# EasyEDA Pro project STM32G431RBT6.epro, board PCB1
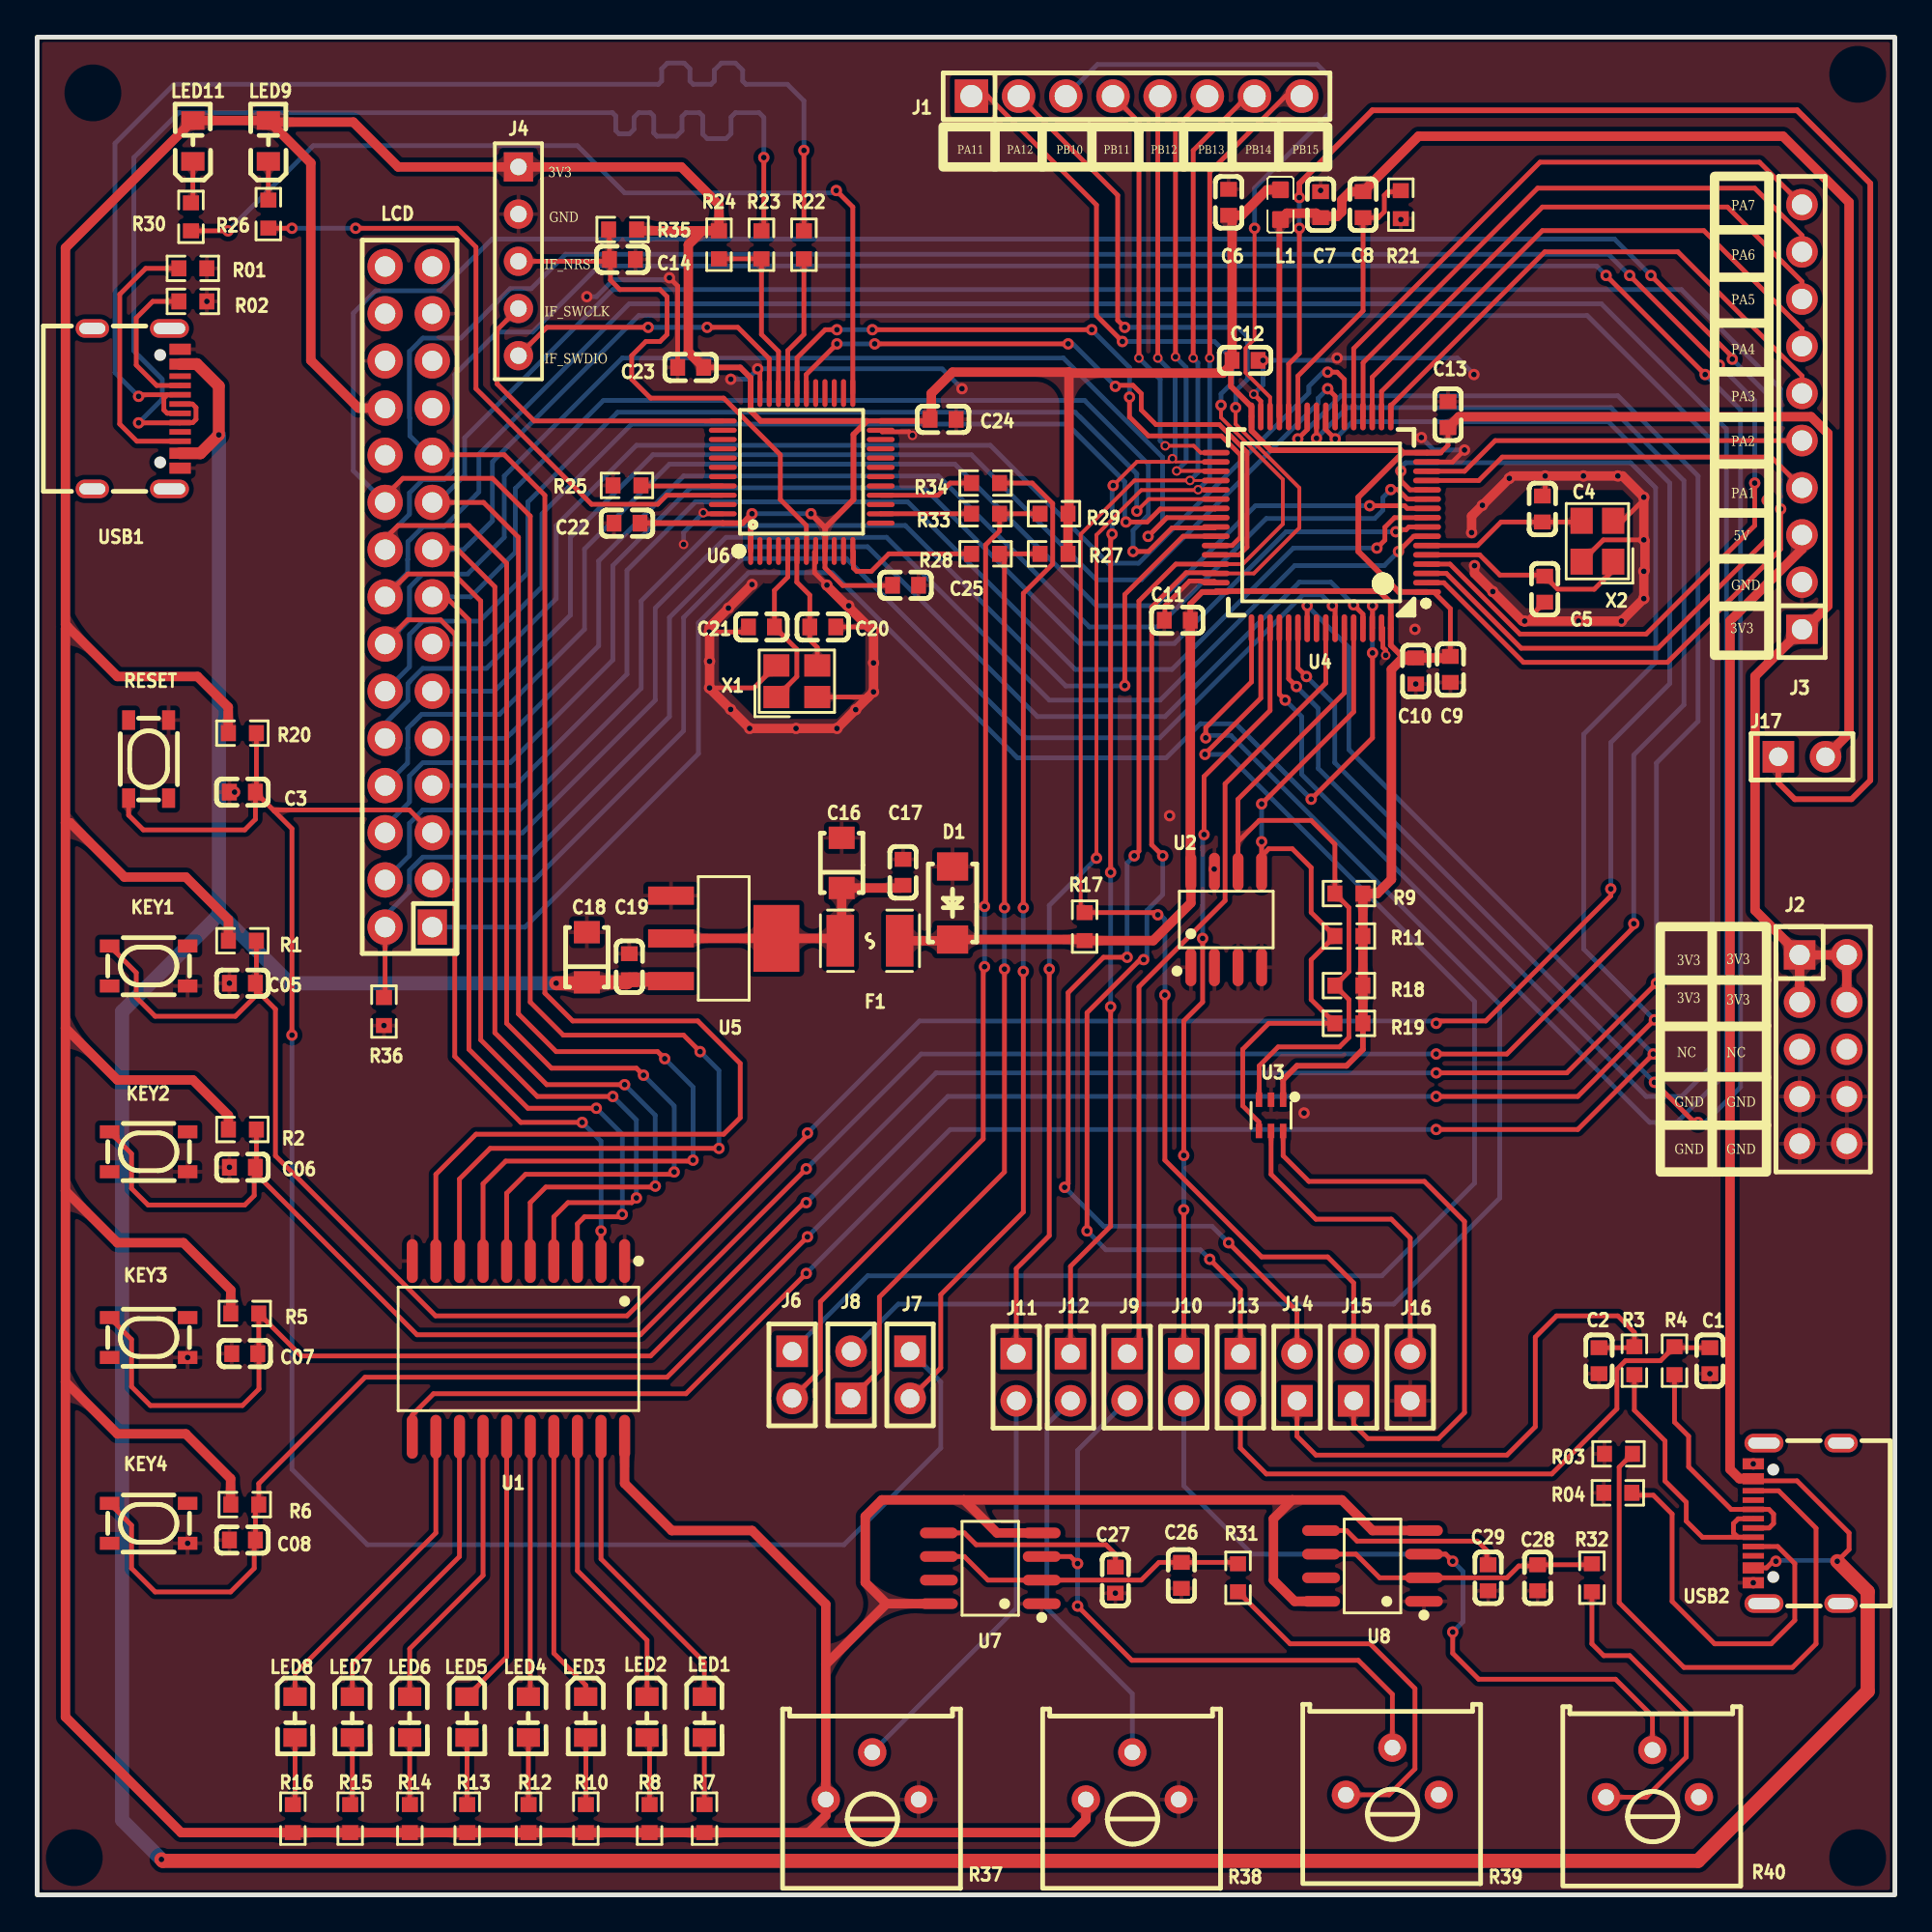
[diagram p1: board, top side]
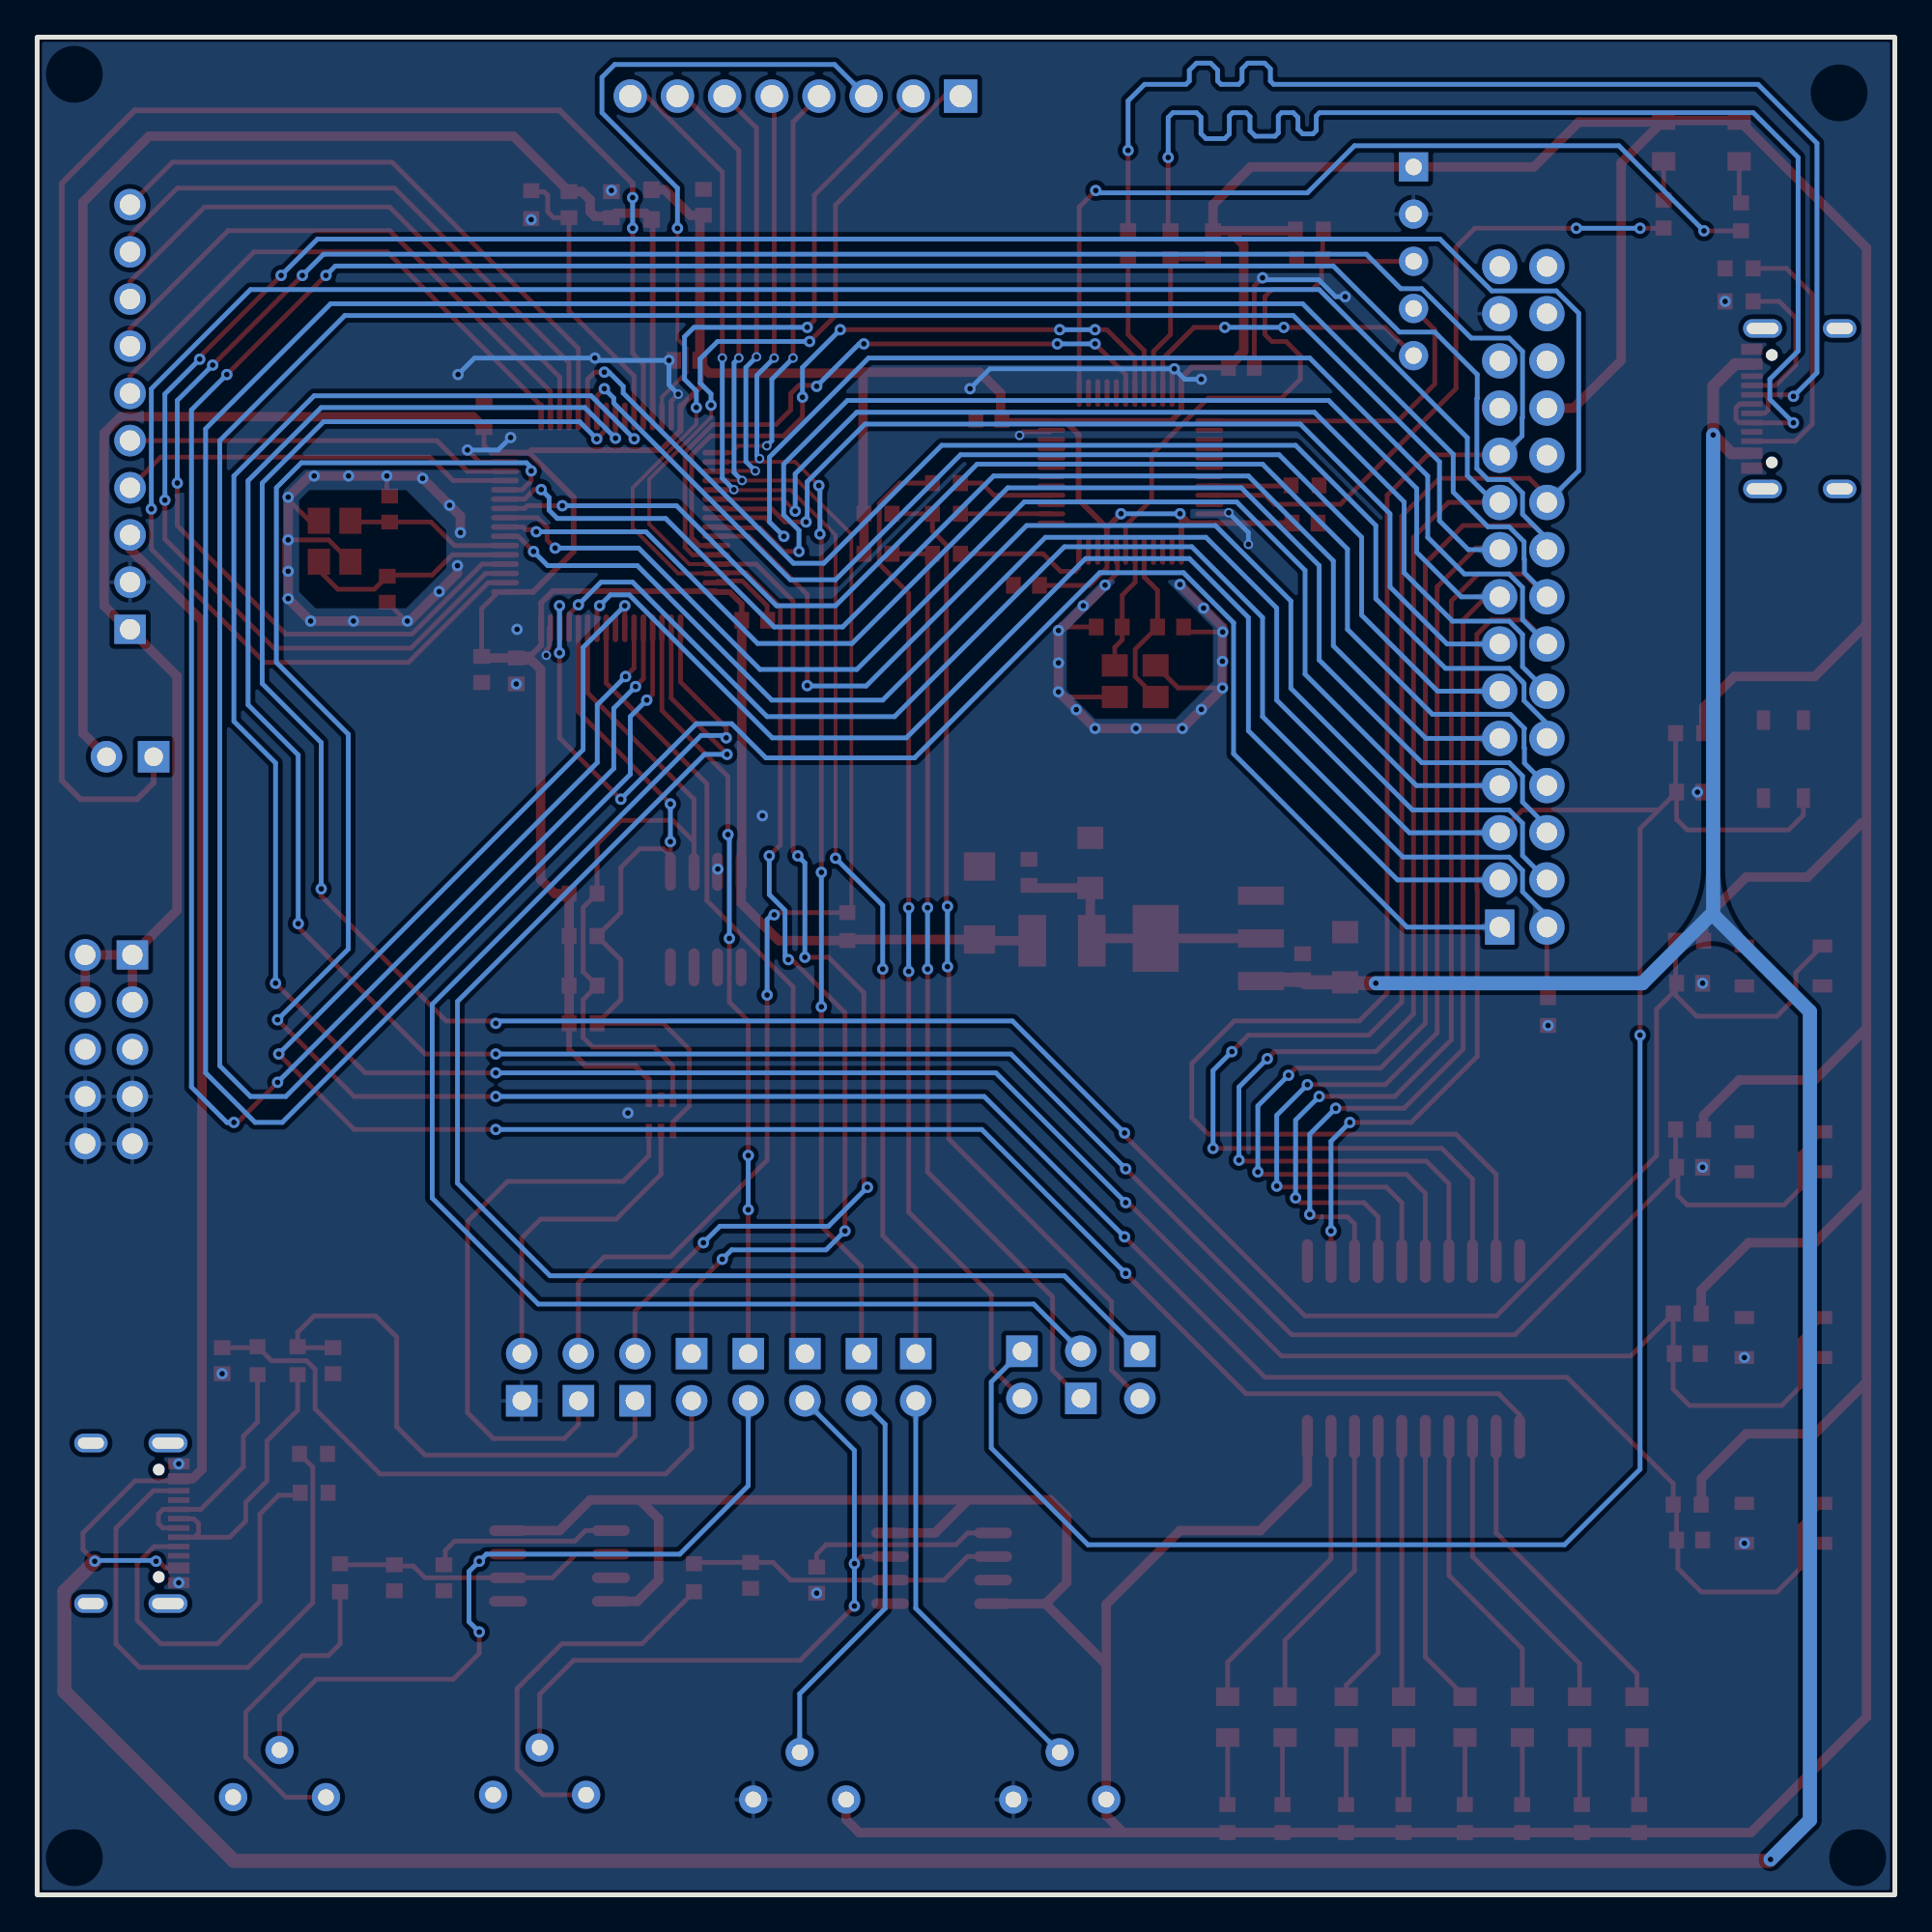
[diagram p2: board, bottom side, seen from below]

Outline 100 x 100 mm; copper layers: Top Layer, Bottom Layer. Coordinates in mm from the lower left corner of the outline.
Outline path: rectangle 0,100 100,0
Stack: Top Layer 0.035mm / Dielectric1 1.51mm FR4 er 4.5 / Bottom Layer 0.035mm

## Design rules (mm)
template: 自定义配置
spacing copperThickness1oz (default): track to track 0.102, other pairs 0.152 to 0.3
spacing copperThickness2oz: track to track 0.203, other pairs 0.152 to 0.3
track width copperThickness1oz (default): min 0.127, default 0.254, max 2.54
track width copperThickness2oz: min 0.203, default 0.254, max 2.54
differential pair differentialPair (default): width min 0.127, default 0.254, max 2.54; gap min 0.152, default 0.152
via viaSize (default): diameter min 0.5, default 0.61, max 10; hole min 0.3, default 0.305, max 6.299

## Placement (name value [footprint] x y rotation side)
C1  20pF  [C0603]  90.04 28.75 270 top
C2  20pF  [C0603]  84.07 28.75 270 top
C3  100nF  [C0603]  11.05 59.36 0 top
C4  20pF  [C0603]  81.03 74.6 270 top
C5  20pF  [C0603]  81.15 70.28 90 top
C05  100nF  [C0603]  11.05 49.07 0 top
C6  100nF  [C0603]  64.13 91.11 270 top
C06  100nF  [C0603]  11.05 39.17 0 top
C7  1uF  [C0603]  69.09 90.98 270 top
C07  100nF  [C0603]  11.18 29.13 0 top
C08  100nF  [C0603]  11.05 19.1 0 top
C8  100nF  [C0603]  71.37 90.98 90 top
C9  100nF  [C0603]  76.07 65.96 90 top
C10  100nF  [C0603]  74.21 65.88 90 top
C11  100nF  [C0603]  61.37 68.61 0 top
C12  100nF  [C0603]  65.02 82.6 180 top
C13  100nF  [C0603]  75.95 79.68 270 top
C14  100nF  [C0603]  31.51 88.04 180 top
C16  22uF  [CAP-SMD_L3.2-W1.6]  43.31 55.55 90 top
C17  100nF  [C0603]  46.61 55.04 270 top
C18  22uF  [CAP-SMD_L3.2-W1.6]  29.59 50.47 90 top
C19  100nF  [C0603]  31.88 49.96 270 top
C20  20pF  [C0603]  42.29 68.25 180 top
C21  20pF  [C0603]  38.99 68.25 0 top
C22  100nF  [C0603]  31.75 73.84 0 top
C23  100nF  [C0603]  35.18 82.22 0 top
C24  100nF  [C0603]  48.77 79.43 180 top
C25  100nF  [C0603]  46.75 70.49 180 top
C26  100nF  [C0603]  61.59 17.2 270 top
C27  10nF  [C0603]  58.04 16.94 270 top
C28  100nF  [C0603]  80.77 17.07 270 top
C29  10nF  [C0603]  78.1 17.07 270 top
D1  SS14  [SMA_L4.2-W2.6-LS5.0-RD_1]  49.28 53.39 90 top
F1  ASMD1210-075-24V  [F1210]  44.83 51.36 0 top
J1  -  [HDR-TH_8P-P2.54-V-F-1]  59.18 96.83 0 top
J2  -  [HDR-TH_10P-P2.54-V-F-R2-C5-S2.54]  96.14 45.52 270 top
J3  -  [HDR-TH_10P-P2.54-V-F]  95 79.55 90 top
J4  HDR-M-2.54_1x5  [HDR-M-2.54_1X5]  25.91 87.94 270 top
J6  -  [HDR-TH_2P-P2.54-V-F]  40.64 27.99 270 top
J7  -  [HDR-TH_2P-P2.54-V-F]  46.99 27.99 270 top
J8  -  [HDR-TH_2P-P2.54-V-F]  43.81 27.99 90 top
J9  -  [HDR-TH_2P-P2.54-V-F]  58.67 27.86 270 top
J10  -  [HDR-TH_2P-P2.54-V-F]  61.72 27.86 270 top
J11  -  [HDR-TH_2P-P2.54-V-F]  52.71 27.86 270 top
J12  -  [HDR-TH_2P-P2.54-V-F]  55.63 27.86 270 top
J13  -  [HDR-TH_2P-P2.54-V-F]  64.77 27.86 270 top
J14  -  [HDR-TH_2P-P2.54-V-F]  67.82 27.86 90 top
J15  -  [HDR-TH_2P-P2.54-V-F]  70.87 27.86 90 top
J16  -  [HDR-TH_2P-P2.54-V-F]  73.91 27.86 90 top
J17  -  [HDR-TH_2P-P2.54-V-F]  95 61.27 0 top
KEY1  SKRPACE010  [KEY-SMD_4P-L4.2-W3.2-P2.20-LS4.6]  6 50 0 top
KEY2  SKRPACE010  [KEY-SMD_4P-L4.2-W3.2-P2.20-LS4.6]  6 40 0 top
KEY3  SKRPACE010  [KEY-SMD_4P-L4.2-W3.2-P2.20-LS4.6]  6 30 0 top
KEY4  SKRPACE010  [KEY-SMD_4P-L4.2-W3.2-P2.20-LS4.6]  6 20 0 top
L1  600Ω@100MHz  [L0603磁珠]  66.93 90.98 270 top
LCD  -  [HDR-TH_30P-P2.54-V-F-R2-C15-S2.54]  20 69.87 90 top
LED1  NCD0805R1  [LED0805-RD]  35.91 9.57 270 top
LED2  NCD0805R1  [LED0805-RD]  32.83 9.57 270 top
LED3  NCD0805R1  [LED0805-RD]  29.53 9.57 270 top
LED4  NCD0805R1  [LED0805-RD]  26.44 9.57 270 top
LED5  NCD0805R1  [LED0805-RD]  23.14 9.57 270 top
LED6  NCD0805R1  [LED0805-RD]  20.05 9.57 270 top
LED7  NCD0805R1  [LED0805-RD]  16.97 9.57 270 top
LED8  NCD0805R1  [LED0805-RD]  13.88 9.57 270 top
LED9  LED0805-G  [LED0805-RD_GREEN]  12.45 94.41 90 top
LED11  NCD0805R1  [LED0805-RD]  8.38 94.41 90 top
R1  10kΩ  [R0603]  11.05 51.36 180 top
R01  5.1kΩ  [R0603]  8.38 87.55 0 top
R2  10kΩ  [R0603]  11.05 41.2 180 top
R02  5.1kΩ  [R0603]  8.38 85.78 0 top
R03  5.1kΩ  [R0603]  85.12 23.74 180 top
R3  33Ω  [R0603]  85.98 28.75 90 top
R04  5.1kΩ  [R0603]  85.09 21.64 180 top
R4  33Ω  [R0603]  88.14 28.75 90 top
R5  10kΩ  [R0603]  11.18 31.29 180 top
R6  10kΩ  [R0603]  11.18 21.01 180 top
R7  300Ω  [R0603]  35.92 4.1 90 top
R8  300Ω  [R0603]  32.97 4.1 90 top
R9  10kΩ  [R0603]  70.61 53.9 0 top
R10  300Ω  [R0603]  29.54 4.1 90 top
R11  10kΩ  [R0603]  70.61 51.61 0 top
R12  300Ω  [R0603]  26.45 4.1 90 top
R13  300Ω  [R0603]  23.15 4.1 90 top
R14  300Ω  [R0603]  20.06 4.1 90 top
R15  300Ω  [R0603]  16.85 4.1 90 top
R16  300Ω  [R0603]  13.76 4.1 90 top
R17  10kΩ  [R0603]  56.39 52.12 90 top
R18  10kΩ  [R0603]  70.61 48.95 0 top
R19  10kΩ  [R0603]  70.61 46.91 0 top
R20  10kΩ  [R0603]  11.05 62.53 0 top
R21  0Ω  [R0603]  73.41 90.98 90 top
R22  33Ω  [R0603]  41.28 88.82 270 top
R23  33Ω  [R0603]  38.99 88.82 270 top
R24  1.5kΩ  [R0603]  36.7 88.82 270 top
R25  100kΩ  [R0603]  31.75 75.87 180 top
R26  300Ω  [R0603]  12.45 90.47 90 top
R27  1.5kΩ  [R0603]  54.74 72.19 0 top
R28  22Ω  [R0603]  51.05 72.19 180 top
R29  1.5kΩ  [R0603]  54.74 74.35 0 top
R30  510Ω  [R0603]  8.28 90.33 90 top
R31  100Ω  [R0603]  64.64 17.07 90 top
R32  100Ω  [R0603]  83.69 17.07 90 top
R33  22Ω  [R0603]  51.05 74.35 180 top
R34  22Ω  [R0603]  51.05 76 180 top
R35  10kΩ  [R0603]  31.51 89.64 0 top
R36  10kΩ  [R0603]  18.67 47.55 90 top
R37  10kΩ  [RES-ADJ-TH_3P-L9.5-W9.5-P2.50-L_3386P]  44.95 6.4 180 top
R38  10kΩ  [RES-ADJ-TH_3P-L9.5-W9.5-P2.50-L_3386P]  58.95 6.4 180 top
R39  10kΩ  [RES-ADJ-TH_3P-L9.5-W9.5-P2.50-L_3386P]  72.95 6.66 180 top
R40  10kΩ  [RES-ADJ-TH_3P-L9.5-W9.5-P2.50-L_3386P]  86.95 6.53 180 top
RESET  SKRPACE010  [KEY-SMD_4P-L4.2-W3.2-P2.20-LS4.6]  6 61.14 90 top
U1  SN74HC573ADWR  [SOIC-20_L13.0-W7.6-P1.27-LS10.3-BL]  25.91 29.39 180 top
U2  M24C02-WMN6TP  [SOIC-8_L4.9-W3.9-P1.27-LS6.0-BL]  64.01 52.5 0 top
U3  MCP4017T-104E/LT  [SC-70-6_L2.2-W1.3-P0.65-LS2.1-BL]  66.42 41.96 180 top
U4  STM32G431RBT6  [LQFP-64_L10.0-W10.0-P0.50-LS12.0-BL]  69.13 73.88 90 top
U5  AMS1117-3.3  [SOT-223-4_L6.5-W3.5-P2.30-LS7.0-BR]  36.96 51.49 180 top
U6  STM32F103C8T6  [LQFP-48_L7.0-W7.0-P0.50-LS9.0-BL]  41.16 76.59 0 top
U7  XL555  [SOP-8_L5.0-W4.0-P1.27-LS6.0-BL]  51.31 17.58 90 top
U8  XL555  [SOP-8_L5.0-W4.0-P1.27-LS6.0-BL]  71.88 17.7 90 top
USB1  TYPE-C16PIN  [USB-C-SMD_TYPE-C16PIN]  5.33 80 270 top
USB2  TYPE-C16PIN  [USB-C-SMD_TYPE-C16PIN]  94.74 20 90 top
X1  8MHz  [CRYSTAL-SMD_4P-L3.2-W2.5-BL]  40.89 65.33 0 top
X2  24MHz  [CRYSTAL-SMD_4P-L3.2-W2.5-BL]  83.99 72.87 90 top

## Footprints (pads in the part's own frame, mm; a bottom-side part is the same pattern mirrored in y, then rotated)
C0603
  rect 0.8x0.9 smd: 1(-0.7,0) 2(0.7,0)
CAP-SMD_L3.2-W1.6
  rect 1.2x1.4 smd: 1(-1.35,0) 2(1.35,0)
CRYSTAL-SMD_4P-L3.2-W2.5-BL
  rect 1.4x1.2 smd: 1(-1.1,-0.85) 2(1.1,-0.85) 3(1.1,0.85) 4(-1.1,0.85)
F1210
  rect 1.485x2.781 smd: 1(-1.6,0) 2(1.6,0)
HDR-M-2.54_1X5
  rect 1.575x1.575 hole 0.889: 1(-5.08,0)
  round 1.575 hole 0.889: 2(-2.54,0) 3(0,0) 4(2.54,0) 5(5.08,0)
HDR-TH_2P-P2.54-V-F
  rect 1.7x1.7 hole 1: 1(-1.27,0)
  round 1.7 hole 1: 2(1.27,0)
HDR-TH_8P-P2.54-V-F-1
  rect 1.8x1.8 hole 1.2: 1(-8.89,0)
  round 1.8 hole 1.2: 2(-6.35,0) 3(-3.81,0) 4(-1.27,0) 5(1.27,0) 6(3.81,0) 7(6.35,0) 8(8.89,0)
HDR-TH_10P-P2.54-V-F
  rect 1.575x1.7 hole 1.1: 1(-11.43,0)
  round 1.7 hole 1.1: 2(-8.89,0) 3(-6.35,0) 4(-3.81,0) 5(-1.27,0) 6(1.27,0) 7(3.81,0) 8(6.35,0) 9(8.89,0) 10(11.43,0)
HDR-TH_10P-P2.54-V-F-R2-C5-S2.54
  rect 1.575x1.7 hole 1.1: 1(-5.08,-1.27)
  round 1.7 hole 1.1: 2(-5.08,1.27) 3(-2.54,-1.27) 4(-2.54,1.27) 5(0,-1.27) 6(0,1.27) 7(2.54,-1.27) 8(2.54,1.27) 9(5.08,-1.27) 10(5.08,1.27)
HDR-TH_30P-P2.54-V-F-R2-C15-S2.54
  rect 1.9x1.575 hole 1.1: 1(-17.78,-1.27)
  round 1.9 hole 1.1: 2(-17.78,1.27) 3(-15.24,-1.27) 4(-15.24,1.27) 5(-12.7,-1.27) 6(-12.7,1.27) 7(-10.16,-1.27) 8(-10.16,1.27) 9(-7.62,-1.27) 10(-7.62,1.27) 11(-5.08,-1.27) 12(-5.08,1.27) 13(-2.54,-1.27) 14(-2.54,1.27) 15(0,-1.27) 16(0,1.27) 17(2.54,-1.27) 18(2.54,1.27) 19(5.08,-1.27) 20(5.08,1.27) 21(7.62,-1.27) 22(7.62,1.27) 23(10.16,-1.27) 24(10.16,1.27) 25(12.7,-1.27) 26(12.7,1.27) 27(15.24,-1.27) 28(15.24,1.27) 29(17.78,-1.27) 30(17.78,1.27)
KEY-SMD_4P-L4.2-W3.2-P2.20-LS4.6
  rect 1.05x0.7 smd: 1(-2.1,1.075) 2(2.1,1.075) 3(-2.1,-1.075) 4(2.1,-1.075)
L0603磁珠
  custom 0.9x0.9 smd: 1(-0.8,0) 2(0.8,0)
LED0805-RD
  rect 1x1.25 smd: 1(-1.1,0) 2(1.1,0)
LED0805-RD_GREEN
  rect 1x1.25 smd: 1(-1.1,0) 2(1.1,0)
LQFP-48_L7.0-W7.0-P0.50-LS9.0-BL
  oval 0.27x1.5 smd: 1(-2.75,-4.25) 2(-2.25,-4.25) 3(-1.75,-4.25) 4(-1.25,-4.25) 5(-0.75,-4.25) 6(-0.25,-4.25) 7(0.25,-4.25) 8(0.75,-4.25) 9(1.25,-4.25) 10(1.75,-4.25) 11(2.25,-4.25) 12(2.75,-4.25) 25(2.75,4.25) 26(2.25,4.25) 27(1.75,4.25) 28(1.25,4.25) 29(0.75,4.25) 30(0.25,4.25) 31(-0.25,4.25) 32(-0.75,4.25) 33(-1.25,4.25) 34(-1.75,4.25) 35(-2.25,4.25) 36(-2.75,4.25)
  oval 1.5x0.27 smd: 13(4.25,-2.75) 14(4.25,-2.25) 15(4.25,-1.75) 16(4.25,-1.25) 17(4.25,-0.75) 18(4.25,-0.25) 19(4.25,0.25) 20(4.25,0.75) 21(4.25,1.25) 22(4.25,1.75) 23(4.25,2.25) 24(4.25,2.75) 37(-4.25,2.75) 38(-4.25,2.25) 39(-4.25,1.75) 40(-4.25,1.25) 41(-4.25,0.75) 42(-4.25,0.25) 43(-4.25,-0.25) 44(-4.25,-0.75) 45(-4.25,-1.25) 46(-4.25,-1.75) 47(-4.25,-2.25) 48(-4.25,-2.75)
LQFP-64_L10.0-W10.0-P0.50-LS12.0-BL
  oval 0.3x1.5 smd: 1(-3.75,-5.688) 2(-3.25,-5.688) 3(-2.75,-5.688) 4(-2.25,-5.688) 5(-1.75,-5.688) 6(-1.25,-5.688) 7(-0.75,-5.688) 8(-0.25,-5.688) 9(0.25,-5.688) 10(0.75,-5.688) 11(1.25,-5.688) 12(1.75,-5.688) 13(2.25,-5.688) 14(2.75,-5.688) 15(3.25,-5.688) 16(3.75,-5.688) 33(3.75,5.688) 34(3.25,5.688) 35(2.75,5.688) 36(2.25,5.688) 37(1.75,5.688) 38(1.25,5.688) 39(0.75,5.688) 40(0.25,5.688) 41(-0.25,5.688) 42(-0.75,5.688) 43(-1.25,5.688) 44(-1.75,5.688) 45(-2.25,5.688) 46(-2.75,5.688) 47(-3.25,5.688) 48(-3.75,5.688)
  oval 1.5x0.3 smd: 17(5.7,-3.738) 18(5.7,-3.238) 19(5.7,-2.738) 20(5.7,-2.238) 21(5.7,-1.738) 22(5.7,-1.238) 23(5.7,-0.739) 24(5.7,-0.238) 25(5.7,0.262) 26(5.7,0.762) 27(5.7,1.262) 28(5.7,1.762) 29(5.7,2.261) 30(5.7,2.762) 31(5.7,3.261) 32(5.7,3.762) 49(-5.7,3.762) 50(-5.7,3.261) 51(-5.7,2.762) 52(-5.7,2.261) 53(-5.7,1.762) 54(-5.7,1.262) 55(-5.7,0.762) 56(-5.7,0.262) 57(-5.7,-0.238) 58(-5.7,-0.739) 59(-5.7,-1.238) 60(-5.7,-1.738) 61(-5.7,-2.238) 62(-5.7,-2.738) 63(-5.7,-3.238) 64(-5.7,-3.738)
R0603
  rect 0.806x0.864 smd: 1(-0.753,0) 2(0.753,0)
RES-ADJ-TH_3P-L9.5-W9.5-P2.50-L_3386P
  round 1.524 hole 0.85: 1(-2.5,1.27) 2(0,-1.27) 3(2.5,1.27)
SC-70-6_L2.2-W1.3-P0.65-LS2.1-BL
  rect 0.35x0.78 smd: 1(-0.65,-0.84) 2(0,-0.84) 3(0.65,-0.84) 4(0.65,0.84) 5(0,0.84) 6(-0.65,0.84)
SMA_L4.2-W2.6-LS5.0-RD_1
  rect 1.52x1.68 smd: 1(-1.965,0) 2(1.965,0)
SOIC-8_L4.9-W3.9-P1.27-LS6.0-BL
  oval 0.588x2.045 smd: 1(-1.905,-2.57) 2(-0.635,-2.57) 3(0.635,-2.57) 4(1.905,-2.57) 5(1.905,2.57) 6(0.635,2.57) 7(-0.635,2.57) 8(-1.905,2.57)
SOIC-20_L13.0-W7.6-P1.27-LS10.3-BL
  oval 0.595x2.36 smd: 1(-5.715,-4.73) 2(-4.445,-4.73) 3(-3.175,-4.73) 4(-1.905,-4.73) 5(-0.635,-4.73) 6(0.635,-4.73) 7(1.905,-4.73) 8(3.175,-4.73) 9(4.445,-4.73) 10(5.715,-4.73) 11(5.715,4.73) 12(4.445,4.73) 13(3.175,4.73) 14(1.905,4.73) 15(0.635,4.73) 16(-0.635,4.73) 17(-1.905,4.73) 18(-3.175,4.73) 19(-4.445,4.73) 20(-5.715,4.73)
SOP-8_L5.0-W4.0-P1.27-LS6.0-BL
  oval 0.574x2.035 smd: 1(-1.905,-2.768) 2(-0.635,-2.768) 3(0.635,-2.768) 4(1.905,-2.768) 5(1.905,2.768) 6(0.635,2.768) 7(-0.635,2.768) 8(-1.905,2.768)
SOT-223-4_L6.5-W3.5-P2.30-LS7.0-BR
  rect 2.47x0.98 smd: 1(2.835,-2.3) 2(2.835,0) 3(2.835,2.3)
  rect 2.47x3.6 smd: 4(-2.835,0)
USB-C-SMD_TYPE-C16PIN
  oval 1x2.1 hole 0.6x1.7: 1(-4.32,1.788) 2(4.32,1.788)
  oval 1x1.8 hole 0.6x1.4: 3(-4.32,-2.362) 4(4.32,-2.362)
  rect 0.6x1.15 smd: A1B12(-3.2,2.362) A4B9(-2.4,2.362) B1A12(3.2,2.362) B4A9(2.4,2.362)
  rect 0.3x1.15 smd: A5(-1.25,2.362) A6(-0.25,2.362) A7(0.25,2.362) A8(1.25,2.362) B5(1.75,2.362) B6(0.75,2.362) B7(-0.75,2.362) B8(-1.75,2.362)

## Nets
As in the schematic.

Pads without a net: J2 5 6; KEY1 2 3; KEY2 2 3; KEY3 2 3; KEY4 2 3; LCD 22 23 25 28 29 30; R39 1; R40 1; RESET 2 3; U4 56; U6 2 3 4 10 11 13 15 17 18 19 20 21 22 26 27 28 29 38 39 40 41 42 43 46; U7 7; U8 7; USB1 1 2 3 4 A8 B8; USB2 1 2 3 4 A8 B8

## Via types
v1: diameter 0.61, hole 0.305, Top Layer to Bottom Layer, 190 vias
v2: diameter 0.508, hole 0.305, Top Layer to Bottom Layer, 15 vias

## Routing (per net, layer and track width the routed paths; a pad name or vN(x,y) marks a point on that pad's centre or on a via; arc(x,y) is an arc through that point)
GND: length 128.7
  Top Layer w0.254: v1(86.49,72.94) 84.31,72.94 X2.4 ; v1(36.18,67.98) 38.02,67.98 38.29,68.25 ; U6.47 35.92,74.34 v2(35.86,74.4) ; U6.35 38.91,82.02 v1(38.78,82.14) ; U4.31 65.87,80.4 v2(65.49,80.78) ; C4.1 81.18,75.45 v1(81.18,76.38) ; U4.63 72.44,68.18 72.44,67.15 72.59,67 v2(72.59,66.73) ; 39.79,66.18 38.58,64.97 v1(36.19,64.97) ; U4.15 76.19,77.13 v1(76.84,77.78) ; X1.2 44.74,64.48 ; v2(47.12,78.56) 46.92,78.75 45.49,78.75 U6.23 ; C20.1 44.76,68.25 ; C11.1 60.71,68.64 60.71,69.39 62.04,70.73 62.64,70.73 62.66,70.7 63.37,70.7 U4.47 ; v1(42.51,70.5) 41.85,71.17 41.85,72.28 U6.8 ; 86.49,75.11 85.35,73.97 X2.2 ; C5.1 80.14,68.57 ; C23.1 34.48,86.6 v1(34.04,87.05)
  Top Layer w0.508: v1(38.48,70.54) v1(37.21,69.27) 36.18,68.23 v1(36.18,67.98) 36.19,67.97 v1(36.19,66.4) v1(36.19,64.97) 36.19,64.95 v1(37.33,63.81) v1(38.35,62.79) v1(40.85,62.79) v1(43.05,62.79) v1(44.06,63.8) v1(45.02,64.76) v1(45.02,66.32) v1(45.02,68.06) 44.83,68.25 44.76,68.25 43.69,69.32 v1(43.69,69.39) 43.58,69.39 42.51,70.46 v1(42.51,70.5) ; v1(77.22,73.33) 77.22,74.22 v1(77.8,74.8) v1(79.25,76.25) 79.38,76.38 v1(81.18,76.38) v1(83.24,76.38) v1(85.09,76.38) 85.34,76.38 v1(86.49,75.23) v1(86.49,72.94) 86.55,72.88 86.55,71.31 v1(86.49,71.25) v1(86.49,69.77) v1(85.28,68.57) v1(82.97,68.57) v1(80.07,68.57) 79.95,68.57 v1(78.36,70.16) 77.37,71.14 v1(77.37,71.55)
  Bottom Layer w0.254: v2(65.49,80.78) 65.99,81.28 v1(65.99,82.6) 69.85,82.6 v1(69.98,82.73) 76.45,82.73 v1(77.34,81.84) ; v1(76.84,77.78) 75.19,77.78 v1(74.51,78.45) ; v2(34.8,72.69) 34.8,73.34 v2(35.86,74.4) ; v1(34.04,87.05) 33.93,86.94 31.02,86.94 30.1,86.03 v1(29.59,86.03) ; v1(37.34,81.58) 38.23,81.58 v1(38.78,82.14) 48.72,82.14 v1(49.78,81.08)
  vias: v1(8.1,28.93) v1(8.1,18.93) v1(9.14,85.78) v1(10.35,49.07) v1(10.35,39.17) v1(10.63,59.36) v1(18.67,46.8) v1(58.04,16.24) v1(60.96,58.09) v1(63.36,55.22) v1(68.2,42.09) v1(69.09,91.75) v1(73.41,90.18) v1(74.17,68.12) v1(74.21,65.18) v1(90.04,28.05) v1(92.38,23.2) v1(92.38,16.8)
GND-ADC: length 15.3
  Top Layer w0.254: R21.2 73.34,91.67 72.7,91.67 72.52,91.49 72.52,90.6 72.2,90.28 C8.1 71.37,85.27 67.87,81.76 U4.27
VDD: length 604
  Top Layer w0.254: C9.2 76.07,69.24 75.18,70.13 U4.1 ; 75.55,77.63 75.95,78.03 C13.2 ; U6.9 42.41,71.44 43.36,70.48 46.03,70.48 C25.2
  Top Layer w0.305: 73.52,77.63 71.12,75.23 71.12,72.31 73.3,70.13 U4.1 ; 73.52,77.63 73.38,77.77 66.42,77.77 65.37,78.82 U4.32 65.37,80.1 64.26,81.2 64.26,82.35 ; 73.52,77.63 U4.16 75.55,77.63 ; U6.9 42.41,72.43 42.42,72.44 42.42,73.58 ; R19.2 71.37,45.51 70.49,44.63 67.82,44.63 67.07,43.88 U3.1 ; U6.24 47.98,79.34 C24.2 ; U6.1 38.41,74.27 37.97,73.84 36.91,73.84 U6.48 32.45,73.84 C22.2 ; C23.2 37.85,82.22 38.41,81.66 U6.36 38.41,79.88 38.95,79.34 44.67,79.34 43.94,78.61 43.94,75.11 42.42,73.58 ; C10.2 74.03,66.76 73.37,66.76 72.87,67.26 U4.64 72.87,69.55 72.24,70.18 63.49,70.18 U4.48 62.72,70.13 62.07,69.49 C11.2 ; 42.42,73.58 v1(41.66,74.35)
  Top Layer w0.508: 1.52,37.9 4.32,35.1 7.87,35.1 10.42,32.55 R5.2 ; 1.52,37.9 1.52,27.61 ; 1.52,37.9 1.52,46.66 ; 1.52,27.61 1.52,9.58 7.75,3.35 R16.1 R15.1 R14.1 R13.1 R12.1 R10.1 R8.1 R7.1 41.53,3.35 ; 1.52,27.61 4.32,24.82 8,24.82 10.41,22.4 10.41,21.01 R6.2 ; 55.54,81.97 49.28,81.97 48.13,80.82 48.13,79.49 C24.2 ; 55.54,81.97 55.59,81.92 63.83,81.92 64.26,82.35 64.26,82.54 C12.2 64.32,90.22 C6.2 64.83,90.41 66.21,91.78 L1.1 ; 55.54,81.97 55.54,74.4 R29.2 R27.2 ; R19.2 R18.2 R11.2 R9.2 72.14,53.9 72.9,54.66 72.9,65.96 73.41,66.47 74.1,66.47 C10.2 75.99,66.58 C9.2 ; U7.4 51.67,19.48 49.89,21.26 ; 1.63,68.27 1.52,68.16 1.52,57.71 ; 1.63,68.27 1.52,68.38 1.52,88.65 LED11.2 LED9.2 ; 1.63,68.27 4.32,65.58 8.64,65.58 10.29,63.93 10.29,62.54 R20.1 ; C11.2 62.07,55.1 U2.8 62.1,53.39 60.08,51.37 R17.1 56.33,51.43 D1.1 49.21,51.36 46.43,51.36 ; R38.3 56.45,4.05 55.75,3.35 41.53,3.35 ; R1.2 10.3,52.49 8,54.79 4.7,54.79 1.78,57.71 1.52,57.71 ; 45.72,15.67 44.58,16.81 44.58,20.37 45.47,21.26 49.89,21.26 ; 45.72,15.67 U7.8 ; 45.72,15.67 42.45,12.4 ; 1.52,46.66 1.52,57.71 ; 1.52,46.66 4.32,43.87 8.38,43.87 10.3,41.95 R2.2 ; 49.89,21.26 67.56,21.26 ; 67.56,21.26 70.23,21.26 71.88,19.61 U8.4 ; 67.56,21.26 66.55,20.24 66.55,16.94 67.69,15.8 U8.8 ; 41.53,3.35 42.45,4.27 R37.3 42.45,12.4 ; C23.2 35.29,82.81 35.29,82.84 35.05,83.07 35.05,88.82 35.81,89.58 ; J2.1 J2.3 ; J2.1 92.47,53 92.47,65.6 95,68.12 95.12,68.12 96.39,69.39 96.39,78.67 95.49,79.57 76.53,79.57 C13.2 ; J2.1 J2.2 J2.4 ; 35.81,89.58 32.34,89.58 R35.2 ; 35.81,89.58 R24.1 36.7,90.98 34.67,93.02 J4.1 19.43,93.02 17.02,95.43 12.53,95.43 14.73,93.23 14.73,82.6 17.3,80.03 LCD.24 ; 42.45,12.4 42.45,15.64 38.48,19.61 34.16,19.61 31.62,22.15 U1.20
  Bottom Layer w0.254: v1(38.48,74.35) v1(41.66,74.35)
VDD-ADC: length 75.5
  Top Layer w0.305: L1.2 66.87,90.12 U4.29
  Top Layer w0.508: L1.2 67.27,90.53 68.84,90.53 C7.2 69.15,90.35 69.98,90.35 70.23,90.6 70.23,91.24 70.68,91.68 C8.2 74.36,94.67 93.98,94.67 97.54,91.11 97.54,62.53 J17.2
ADC-VREF: length 86
  Top Layer w0.254: v1(67.94,89.71) 67.94,82.98 67.37,82.4 U4.28
  Top Layer w0.305: v1(67.94,91.36) 67.94,92.13 71.88,96.06 94.74,96.06 98.68,92.13 98.68,60 97.66,58.98 94.62,58.98 93.73,59.86 J17.1
  Bottom Layer w0.254: v1(67.94,91.36) v1(67.94,89.71)
IF_NRST: length 32.2
  Top Layer w0.254: C14.2 30.71,87.94 J4.3 ; C14.2 30.81,89.6 R35.1 ; C14.2 30.86,87.98 30.86,86.92 31.37,86.41 33.53,86.41 33.91,86.03 33.91,84 33.53,83.62 32.77,83.62 32,82.86 32,81.58 33.02,80.57 36.96,80.57 40,77.52 40,75.11 41.41,73.71 U6.7
IF_SWCLK: length 17.5
  Top Layer w0.254: J4.4 24.77,84.25 24.77,81.33 26.76,79.34 U6.37
IF_SWDIO: length 16.7
  Top Layer w0.254: U6.34 39.41,82.69 37.72,84.38 v1(36.07,84.38) ; J4.5 27.43,84.38 v1(32.89,84.38)
  Bottom Layer w0.254: v1(32.89,84.38) v1(36.07,84.38)
LCD_RST: length 174.2
  Top Layer w0.254: v1(13.72,46.28) 13.72,57.39 12.77,58.34 ; R20.2 11.8,59.41 11.75,59.36 ; 11.75,59.36 11.75,57.9 11.18,57.33 5.72,57.33 4.92,58.12 RESET.1 ; 11.75,59.36 12.77,58.34 ; 12.77,58.34 12.82,58.4 20.04,58.4 LCD.5 ; v1(73.28,72.31) 74.1,73.13 U4.7
  Bottom Layer w0.254: v1(13.72,46.28) 13.72,22.91 17.78,18.85 43.43,18.85 48.64,24.05 48.64,27.61 46.99,29.26 ; LCD.5 26.13,57.17 33.27,64.31 33.27,69.27 37.08,73.08 45.72,73.08 54.48,64.31 60.45,64.31 67.69,71.55 72.52,71.55 v1(73.28,72.31)
OSC-IN: length 9.1
  Top Layer w0.254: U6.5 40.41,70.94 39.69,70.22 C21.2 40.89,67.05 40.89,65.58 X1.1
OSC-OUT: length 6.6
  Top Layer w0.254: U6.6 40.89,72.33 40.89,70.66 41.59,69.97 C20.2 41.59,67.55 41.99,67.15 41.99,66.18
PA0: length 150.3
  Top Layer w0.254: KEY4.1 5.08,19.9 5.08,17.58 6.35,16.31 10.41,16.31 11.68,17.58 11.68,19.04 11.75,19.1 11.75,20.83 R6.1 11.93,22.14 17.65,27.86 33.91,27.86 v1(41.47,35.42) ; v1(87.06,47.1) 82.93,42.98 v1(75.31,42.98) ; v1(73.41,76.65) 73.41,76.12 73.9,75.63 U4.12
  Bottom Layer w0.254: v1(75.31,42.98) 49.02,42.98 v1(41.47,35.42) ; v1(87.06,47.1) 83.25,50.91 83.25,62.47 87.12,66.34 87.12,75.74 85.78,77.09 73.66,77.09 73.41,76.83 v1(73.41,76.65)
PA1: length 21.4
  Top Layer w0.254: U4.13 77.61,76.13 78.87,77.39 93.35,77.39 J3.4
PA2: length 20.9
  Top Layer w0.254: J3.5 78.49,78.28 76.84,76.63 U4.14
PA3: length 29.8
  Top Layer w0.254: U4.17 72.87,80.16 81.15,88.44 88.32,88.44 95,81.77 J3.6
PA4: length 30.7
  Top Layer w0.254: U4.18 72.37,80.93 81.03,89.59 89.72,89.59 95,84.31 J3.7
PA5: length 31.6
  Top Layer w0.254: U4.19 71.87,81.7 81.03,90.86 90.99,90.86 95,86.85 95,85.9
PA6: length 32.4
  Top Layer w0.254: U4.20 71.37,79.59 71.37,82.47 80.77,91.87 92.46,91.87 95,89.33 J3.9
PA7: length 32.9
  Top Layer w0.254: U4.21 70.87,83.24 80.9,93.27 92.71,93.27 J3.10
PA8: length 66.2
  Top Layer w0.254: U4.42 61.68,73.13 58.55,70 v1(58.55,65.09)
  Bottom Layer w0.254: 18.73,54.63 20.04,55.94 20.04,57.68 20.76,58.4 25.97,58.4 32.51,64.95 32.51,69.65 36.58,73.71 46.74,73.71 55.37,65.08 58.53,65.08 v1(58.55,65.09)
PA9: length 36.7
  Top Layer w0.254: v1(43.05,84.25) 42.42,84.25 40.91,82.74 U6.31 ; v1(56.77,84.25) v1(44.96,84.25) ; U4.43 64.33,72.63 64.77,73.08 64.77,77.51 63.74,78.54 59.82,78.54 58.8,79.55 v1(58.8,80.62)
  Bottom Layer w0.254: v1(58.8,80.62) 58.8,82.22 v1(56.77,84.25) ; v1(44.96,84.25) v1(43.05,84.25)
PA10: length 35.3
  Top Layer w0.254: U4.44 64.71,72.13 65.13,72.55 65.13,77.66 63.64,79.14 60.22,79.14 59.44,79.93 59.44,80.81 58.99,81.26 58.09,81.26 v1(58.04,81.2) ; U6.30 41.4,80.85 41.4,81.84 v1(43.05,83.49) ; v1(55.5,83.49) v1(45.09,83.49)
  Bottom Layer w0.254: v1(58.04,81.2) 55.75,83.49 v1(55.5,83.49) ; v1(45.09,83.49) v1(43.05,83.49)
PA11: length 94.9
  Top Layer w0.203: U4.45 64.9,71.63 67.06,73.79 67.06,76.2 63.73,79.53 v1(63.73,80.19)
  Top Layer w0.254: U4.45 61.29,71.63 59.31,69.65 59.31,56.19 v1(59.06,55.93) ; v1(55.31,38.09) 55.5,38.28 55.5,48.56 57.4,50.47 v1(58.67,50.47) ; J14.2 67.82,31.42 v1(64.13,35.1) ; J1.1 51.16,96.83 57.02,90.97 57.02,85.01 v1(58.42,83.62)
  Bottom Layer w0.254: v1(58.67,50.47) 58.67,55.55 v1(59.06,55.93) ; v1(63.73,80.19) 63.73,80.8 64.31,81.38 64.31,82.68 63.37,83.62 v1(58.42,83.62) ; v1(55.31,38.09) 57.4,35.99 63.25,35.99 v1(64.13,35.1)
PA12: length 92
  Top Layer w0.203: v1(64.52,80.06) 64.52,79.17 67.94,75.74 67.94,73.58 65.49,71.13 U4.46
  Top Layer w0.254: J13.1 64.77,32.56 v1(63.12,34.21) ; v1(58.55,84.38) 58.17,84.76 58.17,91.49 J1.2 ; U4.46 63.4,71.17 61.85,71.17 59.99,69.32 59.99,56.53 v1(60.59,55.93) ; v1(56.51,35.74) 56.51,47.48 59.37,50.34 v1(59.56,50.34)
  Bottom Layer w0.254: v1(63.12,34.21) 62.61,34.72 57.53,34.72 v1(56.51,35.74) ; v1(64.52,80.06) 64.52,80.95 65.15,81.58 65.15,83.87 64.64,84.38 v1(58.55,84.38) ; v1(60.59,55.93) 60.59,53.85 59.74,53 59.74,50.52 v1(59.56,50.34)
PA13: length 77.6
  Top Layer w0.254: U4.49 65.37,65.29 62.91,62.83 v1(62.91,62.28)
  Bottom Layer w0.254: v1(62.91,62.28) 63.03,62.41 64.26,62.41 78.73,47.94 78.73,37.51 73.03,31.8 46.35,31.8 43.81,29.26
PA14: length 78.3
  Top Layer w0.254: v1(62.87,61.39) 62.87,61.41 65.87,64.42 U4.50
  Bottom Layer w0.254: 40.64,29.26 44.7,33.33 72.39,33.33 77.37,38.31 77.37,48.09 64.07,61.39 v1(62.87,61.39)
PA15: length 41
  Top Layer w0.254: v1(62.74,51.49) 62.74,48.06 61.72,47.04 v1(61.72,39.8) ; U4.51 66.37,63.75 62.81,60.2 v1(62.81,57.07) ; J10.1 v1(61.72,36.88)
  Bottom Layer w0.254: v1(61.72,36.88) v1(61.72,39.8) ; v1(62.81,57.07) 62.74,57 v1(62.74,51.49)
PB0: length 153.1
  Top Layer w0.254: 11.8,49.02 11.81,49.01 11.81,48.69 12.83,47.68 12.83,39.79 21.45,31.17 31.75,31.17 41.47,40.88 v1(41.47,41.01) ; 11.8,49.02 R1.1 ; 11.8,49.02 11.8,48.43 10.67,47.3 6.35,47.3 5.33,48.31 5.33,49.64 KEY1.1 ; 11.8,49.02 11.75,49.07 ; v1(75.31,46.91) 75.44,47.04 77.98,47.04 84.71,53.77 v1(84.71,54.15) ; v1(69.88,78.38) 69.7,78.55 69.69,78.55 69.34,78.9 69.34,79.56 U4.24
  Bottom Layer w0.254: v1(41.47,41.01) 47.5,47.04 75.18,47.04 v1(75.31,46.91) ; v1(69.88,78.38) 70.8,79.3 84.58,79.3 87.88,76 87.88,65.2 84.71,62.03 v1(84.71,54.15)
PB1: length 150
  Top Layer w0.254: KEY2.1 5.08,39.89 5.08,38.02 5.97,37.14 11.18,37.14 11.68,37.64 11.68,39.1 11.8,39.22 ; 11.8,39.22 R2.1 ; 11.8,39.22 11.8,38.79 20.45,30.15 32.47,30.15 v1(41.4,39.08) ; U4.25 v1(68.87,78.41) ; v1(75.31,45.26) 79.12,45.26 85.95,52.09 v1(85.95,52.28)
  Bottom Layer w0.254: v1(68.87,78.41) 70.52,80.06 84.71,80.06 88.65,76.12 88.65,64.06 85.95,61.36 v1(85.95,52.28) ; v1(75.31,45.26) 47.58,45.26 v1(41.4,39.08)
PB2: length 154.4
  Top Layer w0.254: KEY3.1 5.08,29.9 5.08,27.36 6.1,26.34 11.05,26.34 11.94,27.23 11.94,29.07 C07.2 11.93,29.19 R5.1 14.22,29.01 33.02,29.01 41.28,37.26 v1(41.4,37.26) ; v1(87.17,49.07) 82.34,44.25 v1(75.31,44.25) ; U4.26 68.37,78.88 67.87,78.38 v1(67.86,78.38)
  Bottom Layer w0.254: v1(75.31,44.25) 48.39,44.25 v1(41.4,37.26) ; v1(67.86,78.38) 70.18,80.7 85.09,80.7 89.41,76.38 89.41,63.17 87.17,60.93 v1(87.17,49.07)
PB4: length 43.5
  Top Layer w0.254: U4.57 69.37,65.23 63.95,59.81 63.95,53.52 59.31,48.88 59.31,29.77 J9.1
PB5: length 67.9
  Top Layer w0.254: v1(69.72,69.39) 69.87,69.25 U4.58
  Bottom Layer w0.254: v1(69.72,69.39) 69.14,69.98 68.13,69.98 60.43,62.28 53.21,62.28 43.56,71.93 37.97,71.93 34.8,68.76 34.8,62.66 26.77,54.63 21.27,54.63
PB6: length 40.3
  Top Layer w0.254: 64.64,56.69 64.64,58.98 70.37,64.7 U4.59 ; 64.64,56.69 U2.6 ; 64.64,56.69 65.79,57.84 68.58,57.84 69.86,56.56 R9.1 70.61,53.15 70.61,49.7 R18.1 70.61,48.19 70.61,46.15 70.1,45.64 66.8,45.64 65.79,44.63 65.79,42.82 U3.3
PB7: length 37.5
  Top Layer w0.254: 65.91,56.06 v1(65.91,56.69) ; v1(65.91,58.72) 70.87,63.68 U4.60 ; U3.4 65.77,41.59 64.9,42.47 64.9,45.52 66.29,46.91 R19.1 68.58,48.19 68.58,50.33 R11.1 69.85,51.61 68.58,52.88 68.58,55.3 67.56,56.31 66.29,56.31 66.04,56.06
  Bottom Layer w0.254: v1(65.91,56.69) v1(65.91,58.72)
PB8: length 77.3
  Top Layer w0.254: v1(70.87,69.44) 71.37,68.94 U4.61 ; LCD.2 18.73,48.36 R36.2
  Bottom Layer w0.254: LCD.2 18.73,52.69 20.04,54 20.04,55.14 20.76,55.86 26.47,55.86 34.04,63.42 34.04,68.76 37.85,72.57 44.7,72.57 53.85,63.42 60.71,63.42 67.94,70.66 69.64,70.66 v1(70.87,69.44)
PB9: length 78.8
  Top Layer w0.254: U4.62 71.88,68.2 71.88,69.27 ; v1(68.58,58.98) 71.88,62.28 v1(71.88,66.85)
  Bottom Layer w0.254: v1(71.88,69.39) v1(71.88,66.85) ; LCD.1 26.26,52.09 35.59,61.43 35.59,68.48 38.29,71.17 42.8,71.17 52.77,61.2 60.77,61.2 62.61,63.04 64.52,63.04 v1(68.58,58.98)
PB10: length 35.9
  Top Layer w0.203: v1(65.53,89.71) 65.53,83.74 65.04,83.26 65.04,81.95 66.37,80.62 U4.30
  Bottom Layer w0.254: J1.3 57.08,98.53 68.91,98.53 69.6,97.84 69.6,95.94 65.53,91.87 v1(65.53,89.71)
PB11: length 22.9
  Top Layer w0.203: U4.33 62.63,77.63 62.26,78 v2(60.72,78)
  Top Layer w0.254: v2(59.31,82.73) 59.31,95.43 J1.4
  Bottom Layer w0.254: v2(59.31,82.73) 60.45,81.58 60.45,78.28 v2(60.72,78)
PB12: length 73.9
  Top Layer w0.152: v2(61.11,77.31) 61.29,77.13 U4.34
  Top Layer w0.203: v1(57.92,75.86) 59.2,77.14 60.94,77.14 v2(61.11,77.31)
  Top Layer w0.254: J1.5 60.32,96.7 v2(60.32,82.73) ; v1(57.86,73.25) 57.78,73.17 v1(57.78,55.04) ; J12.1 55.63,33.83 57.78,35.99 v1(57.78,47.8)
  Bottom Layer w0.254: v2(61.11,77.31) 61.26,77.46 61.26,81.8 v2(60.32,82.73) ; v1(57.92,75.86) 57.86,75.8 v1(57.86,73.25) ; v1(57.78,47.8) v1(57.78,55.04)
PB13: length 23.4
  Top Layer w0.203: U4.35 63.42,76.65 v2(61.34,76.65)
  Top Layer w0.254: J1.6 61.28,95.11 v2(61.28,82.79)
  Bottom Layer w0.254: v2(61.28,82.79) 61.85,82.22 61.85,77.16 v2(61.34,76.65)
PB14: length 85.6
  Top Layer w0.152: v2(62.06,76.14) 63.44,76.14 U4.36
  Top Layer w0.203: R17.2 56.17,53.09 56.17,73.24 59.07,76.14 v2(62.06,76.14)
  Top Layer w0.254: v1(60.71,48.44) 60.71,39.55 65.91,34.34 69.47,34.34 70.87,32.94 J15.2 ; v1(60.32,52.76) 60.21,52.87 R17.2 ; v2(62.23,82.73) 62.23,93.9 65.15,96.83 J1.7
  Bottom Layer w0.254: v1(60.71,48.44) 60.71,52.5 60.45,52.76 v1(60.32,52.76) ; v2(62.23,82.73) 62.48,82.47 62.48,76.56 v2(62.06,76.14)
PB15: length 77.3
  Top Layer w0.203: U4.37 63.42,75.62 59.44,75.62 57.02,73.2 v1(57.02,55.8)
  Top Layer w0.254: J11.1 52.71,33.71 54.48,35.48 v1(54.48,49.83) ; v2(63.12,82.73) 63.12,92.74 67.2,96.83 J1.8
  Bottom Layer w0.254: v2(62.49,75.64) 63.12,76.27 v2(63.12,82.73) ; v1(57.02,55.8) 54.48,53.26 v1(54.48,49.83)
PC0: length 73.8
  Top Layer w0.254: U4.8 73.84,73.63 73.69,73.49 73.25,73.49 v1(73.13,73.38)
  Bottom Layer w0.254: LCD.6 18.73,57.52 20.04,58.83 20.04,60.22 20.76,60.94 25.46,60.94 30.99,66.47 30.99,71.55 35.18,75.74 47.75,75.74 56.13,67.36 61.21,67.36 67.23,73.38 v1(73.13,73.38)
PC1: length 70.7
  Top Layer w0.254: v1(72.12,72.5) 72.55,72.93 72.55,73.62 73.06,74.13 U4.9
  Bottom Layer w0.254: 21.27,59.71 25.75,59.71 31.75,65.71 31.75,71.3 35.43,74.98 46.86,74.98 55.88,65.96 61.09,65.96 67.62,72.5 v1(72.12,72.5)
PC2: length 72.3
  Top Layer w0.254: v1(71.73,74.78) 73.61,74.78 73.75,74.63 U4.10
  Bottom Layer w0.254: v1(71.73,74.78) 65.58,74.78 60.2,69.39 57.02,69.39 49.4,77.01 34.04,77.01 29.46,72.44 29.46,68.12 24.89,63.55 20.7,63.55 19.94,62.79 19.94,62.78 19.96,62.76 19.96,61.74 19.94,61.72 19.94,60.92 18.73,59.71
PC3: length 69.1
  Top Layer w0.254: U4.11 73.76,75.13 73.25,75.65 v1(72.87,75.65)
  Bottom Layer w0.254: LCD.9 25.25,62.25 30.23,67.23 30.23,71.81 34.8,76.38 48.51,76.38 56.64,68.25 60.32,68.25 66.17,74.09 72,74.09 72.44,74.53 72.44,75.22 v1(72.87,75.65)
PC4: length 70.8
  Top Layer w0.254: v1(69.47,81.97) 69.98,81.97 70.37,81.58 U4.22
  Bottom Layer w0.254: v1(69.47,81.97) 69.22,81.97 68.45,81.2 68.45,80.84 59.29,71.68 57.66,71.68 51.31,78.03 32.26,78.03 27.94,73.71 27.94,69.77 24.19,66.02 20.76,66.02 20.04,65.3 20.04,65.28 19.96,65.2 19.96,64.28 18.73,63.05 LCD.10
PC5: length 64.8
  Top Layer w0.254: U4.23 69.87,80.68 v1(69.47,81.08)
  Bottom Layer w0.254: v1(69.47,81.08) 68.96,80.57 68.96,80.3 59.45,70.79 57.02,70.79 50.29,77.52 33.15,77.52 28.7,73.08 28.7,68.89 24.61,64.79 LCD.11
PC6: length 57.8
  Top Layer w0.203: U4.38 59.84,75.13 v1(59.19,74.49)
  Bottom Layer w0.254: LCD.12 20.04,66.1 20.04,67.84 20.76,68.56 23.81,68.56 26.42,71.17 26.42,74.98 31.24,79.81 55.88,79.81 59.19,76.49 v1(59.19,74.49)
PC7: length 53.1
  Top Layer w0.254: v1(58.61,73.9) 59.75,73.9 60.45,74.6 63.41,74.6 U4.39
  Bottom Layer w0.254: v1(58.61,73.9) 58.55,73.97 58.55,76.06 55.44,79.17 32,79.17 27.18,74.35 27.18,70.41 24.1,67.33 LCD.13
PC8: length 105.6
  Top Layer w0.254: v1(59.8,73.13) 60.81,74.13 U4.40 ; v1(29.34,41.58) 26.03,41.58 22.48,45.14 22.48,54.1 22.5,54.12 22.5,67.84 22.48,67.86 22.48,67.87 21.72,68.63 19.94,68.63 18.73,67.42 LCD.14 ; U1.2 v1(30.35,35.74)
  Bottom Layer w0.254: LCD.14 20.04,68.64 20.04,70.38 20.76,71.1 23.17,71.1 25.15,73.08 25.15,76.38 31.5,82.73 55.25,82.73 60.58,77.39 60.58,73.9 v1(59.8,73.13) ; v1(29.34,41.58) 30.35,40.56 v1(30.35,35.74)
PC9: length 101.1
  Top Layer w0.254: LCD.15 21.37,69.77 22.1,69.77 23.24,68.63 23.24,45.52 26.42,42.34 v1(30.1,42.34) ; v1(58.99,72.31) 59.82,72.31 61.09,73.58 63.39,73.58 U4.41 ; U1.3 29.08,36.12 29.46,36.5 31.37,36.5 v1(31.5,36.63)
  Bottom Layer w0.254: v1(31.5,36.63) 31.5,40.94 v1(30.1,42.34) ; LCD.15 23.34,69.87 25.74,72.27 25.74,75.7 30.48,80.44 56.39,80.44 59.82,77.01 59.82,74.28 58.99,73.46 v1(58.99,72.31)
PC10: length 210
  Top Layer w0.254: v1(30.99,42.98) 26.92,42.98 23.88,46.03 23.88,69.65 22.42,71.1 19.96,71.1 LCD.16 ; v1(32.26,37.52) 32,37.26 28.57,37.26 27.81,36.5 U1.4 ; U4.52 66.87,64.63 v1(67.18,64.31)
  Bottom Layer w0.254: v1(67.18,64.31) 68.07,63.42 68.07,60.31 86.81,41.58 88.26,41.58 90.93,44.25 90.93,78.92 84.2,85.65 31.88,85.65 23.77,77.55 23.77,75.51 21.9,73.64 20.76,73.64 19.96,72.84 19.96,71.9 19.94,71.88 19.94,71.17 18.73,69.96 LCD.16 ; v1(30.99,42.98) 32.26,41.71 v1(32.26,37.52)
PC11: length 202.6
  Top Layer w0.254: v1(33.27,38.15) 33.22,38.1 27.38,38.1 26.54,37.26 U1.5 ; U4.53 67.37,65.46 v1(67.79,65.04) ; 21.27,72.41 21.36,72.5 22.54,72.5 24.64,70.41 24.64,46.41 27.43,43.61 v1(31.62,43.61)
  Bottom Layer w0.254: v1(67.79,65.04) 68.96,63.87 68.96,60.63 86.61,42.98 88.52,42.98 90.17,44.63 90.17,78.28 83.44,85.01 32.38,85.01 24.51,77.14 24.51,73.97 22.96,72.41 21.27,72.41 ; v1(33.27,38.15) 33.27,41.96 v1(31.62,43.61)
PC12: length 222.3
  Top Layer w0.254: v1(89.79,81.84) v1(84.46,87.17) ; v1(32.64,44.12) 32.26,44.5 27.69,44.5 25.27,46.91 25.27,71.68 23.24,73.71 19.43,73.71 18.73,73.01 18.73,72.41 ; U4.54 67.87,66.04 v1(68.33,65.58) ; v1(34.29,38.91) 34.16,38.79 26.29,38.79 25.27,37.77 U1.6 ; v1(87.06,43.74) 89.22,41.58 v1(89.41,41.58)
  Bottom Layer w0.254: v1(89.41,41.58) 89.79,41.58 91.69,43.48 91.69,79.93 v1(89.79,81.84) ; v1(84.46,87.17) 83.95,87.68 30.23,87.68 26.67,84.12 24.77,84.12 22.48,81.84 22.48,80.56 22.5,80.54 22.5,76.78 21.9,76.18 20.76,76.18 20.04,75.46 20.04,74.32 18.73,73.01 18.73,72.41 ; v1(32.64,44.12) 34.29,42.47 v1(34.29,38.91) ; v1(68.33,65.58) 69.85,64.06 69.85,60.95 v1(87.06,43.74)
PC13: length 174.7
  Top Layer w0.254: LCD.19 24.03,74.95 25.91,73.08 25.91,47.42 27.94,45.39 33.4,45.39 v1(33.78,45.01) ; v1(93.85,74.6) 93.85,72.44 87.76,66.34 80.01,66.34 75.72,70.63 U4.2 ; v1(35.31,39.55) 35.25,39.5 25.22,39.5 24,38.28 U1.7
  Bottom Layer w0.254: v1(35.31,39.55) 35.31,43.48 v1(33.78,45.01) ; LCD.19 21.56,74.95 23.01,76.4 23.01,78.44 30.99,86.41 88.51,86.41 93.85,81.07 v1(93.85,74.6)
PC14: length 192.9
  Top Layer w0.254: U4.3 75.86,71.13 79.88,67.11 87.25,67.11 93.12,72.98 v1(93.12,75.08) ; U1.8 22.73,38.53 24.38,40.18 v1(36.7,40.18) ; LCD.20 18.73,75.3 19.69,76.25 24.51,76.25 26.54,74.22 26.54,48.06 28.32,46.28 34.8,46.28 v1(35.69,45.39) ; v1(91.25,82.66) 91.25,82.79 v1(86.87,87.17)
  Bottom Layer w0.254: v1(93.12,75.08) 93.12,80.79 v1(91.25,82.66) ; v1(86.87,87.17) 84.91,89.13 24.48,89.13 21.7,86.34 18.22,86.34 17.02,85.14 17.02,76.67 LCD.20 ; v1(36.7,40.18) 36.7,44.37 v1(35.69,45.39)
PC15: length 183.5
  Top Layer w0.254: U4.4 76.06,71.63 79.82,67.87 86.61,67.87 92.46,73.71 v1(92.46,76) ; v1(90.55,82.35) v1(85.72,87.17) ; U1.9 21.46,38.79 23.62,40.94 36.96,40.94 37.85,41.83 37.85,44.75 35.56,47.04 28.83,47.04 27.33,48.54 27.33,75.34 25.15,77.52 21.3,77.52 21.27,77.49
  Bottom Layer w0.254: v1(90.55,82.35) 92.46,80.44 v1(92.46,76) ; v1(85.72,87.17) 84.58,88.32 28.45,88.32 26.59,86.46 25.47,86.46 22.81,83.8 20.76,83.8 20.04,83.08 20.04,79.52 20.07,79.5 20.07,78.54 21.11,77.49 21.27,77.49
PD2: length 109.1
  Top Layer w0.254: U1.11 20.19,25.83 21.34,26.97 34.93,26.97 v1(41.4,33.45) ; v1(75.31,41.2) 82.93,41.2 v1(87,45.26) ; U4.55 v1(68.37,69.39)
  Bottom Layer w0.254: v1(68.37,69.39) 70.61,67.15 70.61,61.65 v1(87,45.26) ; v1(41.4,33.45) 49.15,41.2 v1(75.31,41.2)
PF0: length 11.7
  Top Layer w0.254: X2.1 84.84,71.3 83.82,70.28 81.85,70.28 C5.2 81.09,71.04 78.74,71.04 77.65,72.13 U4.5
PF1: length 8.9
  Top Layer w0.254: X2.3 83.07,73.9 C4.2 78.8,73.9 77.53,72.63 U4.6
TGT_NRESET: length 54.7
  Top Layer w0.254: R34.1 53.56,76 54.67,74.89 54.67,71.64 53.09,70.06 v1(53.09,53.14) ; v1(53.09,49.71) 53.09,36.75 48.64,32.31 48.64,28.37 J7.2
  Bottom Layer w0.254: v1(53.09,53.14) v1(53.09,49.71)
TGT_SWCLK: length 54.4
  Top Layer w0.254: v1(51,49.96) 50.93,49.89 50.93,40.69 42.16,31.93 42.16,28.25 J6.2 ; v1(51,53.21) 51.05,53.26 51.05,72.66 51.81,73.42 R33.1 R29.1
  Bottom Layer w0.254: v1(51,53.21) v1(51,49.96)
TGT_SWDIO: length 51.2
  Top Layer w0.254: v1(52.07,53.14) 52.07,71.92 R28.1 R27.1 ; v1(52.07,49.83) 52.07,38.91 45.34,32.18 45.34,28.25 J8.1
  Bottom Layer w0.254: v1(52.07,53.14) v1(52.07,49.83)
USB_D+: length 9.9
  Top Layer w0.254: R24.2 R23.2 38.99,84 39.91,83.08 U6.33
USB_D-: length 7.6
  Top Layer w0.254: R22.2 41.28,84 40.41,83.13 U6.32
V_USB: length 283
  Top Layer w0.254: USB2.A4B9 93.09,17.6 93.45,17.96 v1(93.6,17.96) ; USB2.B4A9 92.49,22.29 94.73,22.29 97.54,19.48 97.54,18.59 v1(96.9,17.96)
  Top Layer w0.508: J3.3 95,72.44 91.13,68.57 91.13,22.91 91.63,22.4 92.38,22.4 USB2.B4A9
  Top Layer w0.635: USB1.A4B9 8.59,82.4 9.78,81.22 v1(9.78,78.59) 8.79,77.6 USB1.B4A9
  Top Layer w0.762: v1(96.9,17.96) 98.54,16.32 98.54,10.96 89.41,1.83 6.77,1.83 v1(6.69,1.91) ; U5.3 34.05,49.26 C19.2 31.74,49.12 C18.1 29.54,49.07 v1(27.94,49.07)
  Bottom Layer w0.254: v1(93.6,17.96) 93.64,18 96.86,18 v1(96.9,17.96)
  Bottom Layer w0.762: v1(6.69,1.91) 4.57,4.02 4.57,47.55 9.78,52.76 9.78,52.88 ; 9.78,52.88 13.59,49.07 v1(27.94,49.07) ; 9.78,52.88 v1(9.78,78.59)
$1N293: length 67.4
  Top Layer w0.254: v1(5.46,80.67) 5.55,80.75 7,80.75 ; USB1.B7 7,80.75 ; 7,80.75 6.82,80.57 6.82,79.93 7,79.75 7.69,79.75 USB1.A7 ; v1(41.28,93.9) R22.1
  Bottom Layer w0.254: v1(41.28,93.9) 41.28,96.57 40.39,97.46 38.16,97.46 37.98,97.64 37.98,98.22 37.59,98.6 36.83,98.6 36.45,98.23 36.45,97.64 36.27,97.46 35.32,97.46 35.14,97.64 35.14,98.3 34.83,98.6 33.92,98.6 33.62,98.3 33.62,97.64 33.44,97.46 7.37,97.46 4.19,94.28 4.19,81.94 v1(5.46,80.67)
$1N298: length 8.3
  Top Layer w0.254: R02.1 6.22,85.78 5.33,84.89 5.33,82.35 6.43,81.25 USB1.A5 7.95,81.25
$1N932: length 15.4
  Top Layer w0.508: C17.2 46.47,54.2 C16.1 43.31,51.44 F1.1 43.1,51.49 U5.4 U5.2
$1N1766: length 67.4
  Top Layer w0.254: v1(39.12,93.52) 39.12,89.7 R23.1 ; v1(5.46,79.24) 7.68,79.24 USB1.B6 8.37,79.25 8.55,79.43 8.55,80.06 8.36,80.25 USB1.A6
  Bottom Layer w0.254: v1(39.12,93.52) 39.12,95.68 38.86,95.94 37.59,95.94 37.35,95.7 37.35,94.81 37.08,94.54 36.07,94.54 35.83,94.78 35.83,95.76 35.65,95.94 34.93,95.94 34.71,95.72 34.71,94.96 34.42,94.67 33.37,94.67 33.19,94.85 33.19,95.76 33.01,95.94 32.38,95.94 32.13,95.68 32.13,95.05 31.88,94.79 31.32,94.79 31.14,94.97 31.14,95.76 30.97,95.94 7.62,95.94 5.21,93.52 5.21,83.11 6.73,81.58 6.73,80.51 v1(5.46,79.24)
$1N1770: length 14.4
  Top Layer w0.254: R01.1 5.84,87.55 4.44,86.16 4.44,79.17 5.37,78.25 USB1.B5
$1N2073: length 2.1
  Top Layer w0.254: LED9.1 R26.2
$1N2077: length 35.3
  Top Layer w0.254: v1(17.14,89.71) 22.61,89.71 23.62,88.7 23.62,81.08 29.84,74.85 33.4,74.85 33.89,75.34 U6.45 ; v1(13.72,89.71) 12.45,89.71 R26.1
  Bottom Layer w0.254: v1(17.14,89.71) v1(13.72,89.71)
$1N2171: length 4.4
  Top Layer w0.254: R25.1 32.53,75.84 U6.44
$1N2382: length 49
  Top Layer w0.254: U6.25 43.91,90.85 v1(43.02,91.75) ; R30.1 v1(10.27,89.57)
  Bottom Layer w0.254: v1(10.27,89.57) 14.86,94.16 29.08,94.16 31.62,91.62 42.89,91.62 v1(43.02,91.75)
$1N2584: length 2.3
  Top Layer w0.254: LED11.1 8.38,91.18 R30.2
$1N3400: length 7.8
  Top Layer w0.254: R28.2 45.85,72.19 44.91,71.25 44.12,71.25 43.94,71.42 43.94,72.31 U6.12
$1N3632: length 4.9
  Top Layer w0.254: U6.14 45.41,74.35 R33.2
$1N3787: length 5.2
  Top Layer w0.254: U6.16 48.49,75.34 49.15,76 R34.2
$1N10750: length 3.6
  Top Layer w0.254: R7.2 35.91,4.87 LED1.2
$1N10754: length 3.7
  Top Layer w0.254: R8.2 32.97,8.33 LED2.2
$1N10759: length 3.6
  Top Layer w0.254: LED3.2 29.54,8.46 R10.2
$1N10764: length 3.6
  Top Layer w0.254: LED4.2 26.44,4.87 R12.2
$1N10769: length 3.6
  Top Layer w0.254: LED5.2 23.14,4.87 R13.2
$1N10774: length 3.6
  Top Layer w0.254: R14.2 20.05,4.87 20.05,8.47
$1N10779: length 3.7
  Top Layer w0.254: LED7.2 16.97,4.97 R15.2
$1N10784: length 3.7
  Top Layer w0.254: LED8.2 13.88,4.97 R16.2
$1N10789: length 16.3
  Top Layer w0.254: U1.19 30.35,18.09 35.91,12.52 35.91,10.67
$1N10794: length 15.5
  Top Layer w0.254: U1.18 29.08,17.45 32.83,13.7 32.83,10.67
$1N10799: length 14.7
  Top Layer w0.254: U1.17 27.81,13 29.53,11.29 29.53,10.67
$1N10804: length 14
  Top Layer w0.254: 26.44,10.67 26.54,10.77 U1.16
$1N10809: length 14.9
  Top Layer w0.254: U1.15 25.27,12.8 23.14,10.67
$1N10814: length 15.6
  Top Layer w0.254: U1.14 24,17.2 20.05,13.25 20.05,10.67
$1N10822: length 16.4
  Top Layer w0.254: U1.13 22.73,18.21 16.97,12.45 16.97,10.67
$1N10827: length 17.1
  Top Layer w0.254: 13.88,10.67 13.88,11.9 21.46,19.48 U1.12
$1N11521: length 17.5
  Top Layer w0.254: J16.2 73.91,35.36 72.9,36.37 68.83,36.37 66.42,38.79 U3.5
$1N11558: length 31
  Top Layer w0.254: J15.1 70.87,25.32 71.63,24.56 75.44,24.56 76.84,25.96 76.84,36.25 74.68,38.41 68.45,38.41 67.07,39.79 U3.6
$1N12241: length 22.1
  Bottom Layer w0.254: J11.2 52.71,15.42 R37.2
$1N12250: length 21.4
  Bottom Layer w0.254: R38.2 58.95,10.82 54.36,15.42 54.36,25.32 J12.2
$1N12886: length 15.4
  Top Layer w0.254: U8.6 70.99,18.34 72.26,17.07 79.12,17.07 79.76,17.7 80.71,17.7 C28.1 83.64,17.77 R32.2
$1N13012: length 41.8
  Top Layer w0.254: U8.3 75.82,18.34 v1(76.2,17.96) ; R40.2 86.95,9.62 84.96,11.61 77.6,11.61 76.2,13 v1(76.2,14.15)
  Bottom Layer w0.254: J10.2 61.72,22.02 65.41,18.34 75.82,18.34 v1(76.2,17.96) 76.75,17.4 76.75,14.7 v1(76.2,14.15)
$1N13102: length 17
  Top Layer w0.254: R40.3 86.61,5.26 88.77,7.42 88.77,9.83 85.72,12.88 84.33,12.88 83.69,13.51 R32.1
$1N13144: length 10.2
  Top Layer w0.254: U8.5 70.49,19.61 71.05,19.04 77.53,19.04 78.03,18.54 78.03,17.84 C29.1
$1N13445: length 17.1
  Top Layer w0.254: U7.6 49.91,18.21 51.18,16.94 U7.2 59.44,16.94 60.39,17.9 C26.1 64.57,17.9 R31.2
$1N13461: length 36
  Top Layer w0.254: U7.3 55.63,18.21 v1(56.01,17.83) ; v1(56.01,15.54) 58.93,12.62 71.12,12.62 72.95,10.79 R39.2
  Bottom Layer w0.254: v1(56.01,15.54) v1(56.01,17.83) 56.01,23.93 J9.2
$1N13465: length 20.3
  Top Layer w0.254: R39.3 72.77,5.38 74.17,6.78 74.17,11.1 71.75,13.51 67.45,13.51 R31.1
$1N13467: length 10.7
  Top Layer w0.254: C27.1 58.04,18.34 57.53,18.85 50.55,18.85 49.91,19.48 U7.5
$1N14145: length 15
  Top Layer w0.254: 91.54,19.25 89.64,19.25 88.77,20.12 88.77,21.13 87.63,22.28 87.63,24.44 85.98,26.09 R3.1 ; 91.54,19.25 USB2.B7 ; 91.54,19.25 91.31,19.48 91.31,19.99 91.57,20.24 92.37,20.24 USB2.A7
$1N14150: length 21.1
  Top Layer w0.254: USB2.A5 93.7,18.75 94.62,17.83 94.62,14.78 93.34,13.51 90.3,13.51 88.01,15.8 88.01,20.5 87,21.51 85.97,21.51 R04.1
$1N14152: length 31.3
  Top Layer w0.254: USB2.B5 93.74,21.75 95.76,19.74 95.76,13.51 94.49,12.24 88.65,12.24 85.16,15.73 85.16,23.02 R03.1
$1N14154: length 12.6
  Top Layer w0.254: R4.1 88.14,25.45 88.9,24.69 88.9,23.04 91.19,20.75 USB2.B6 92.38,20.75 93.22,20.75 93.47,20.5 93.47,19.99 93.23,19.75 USB2.A6
$1N14165: length 29.5
  Top Layer w0.254: C2.1 85.93,29.45 R3.2 85.98,30.28 85.09,31.17 81.79,31.17 80.65,30.02 80.65,25.2 79.12,23.67 68.83,23.67 67.82,24.69 J14.1
$1N14181: length 32.5
  Top Layer w0.254: J13.2 64.77,24.05 66.17,22.66 81.53,22.66 85.04,26.16 85.04,28.29 85.5,28.75 87.38,28.75 R4.2 88.19,29.45 C1.1

## Copper pours and planes (outline as drawn; the poured copper is in the pictures)
GND on Top Layer: 0,100 100,100 100,0 0,0
GND on Bottom Layer: 0,100 100,100 100,0 0,0

Small or netless copper shapes (teardrops, artwork), in the pictures only: 515 on Top Layer, 163 on Bottom Layer

## Text on the board
Top Silkscreen Layer: PA11 | PA12 | PB10 | PB11 | PB12 | PB13 | PB14 | PB15 | IF_NRST | IF_SWCLK | IF_SWDIO | 3V3 | GND | NC | PA7 | PA6 | PA5 | PA4 | PA3 | PA2 | PA1 | 5V
